# Altium schematic sheet MPU.SchDoc
size A4
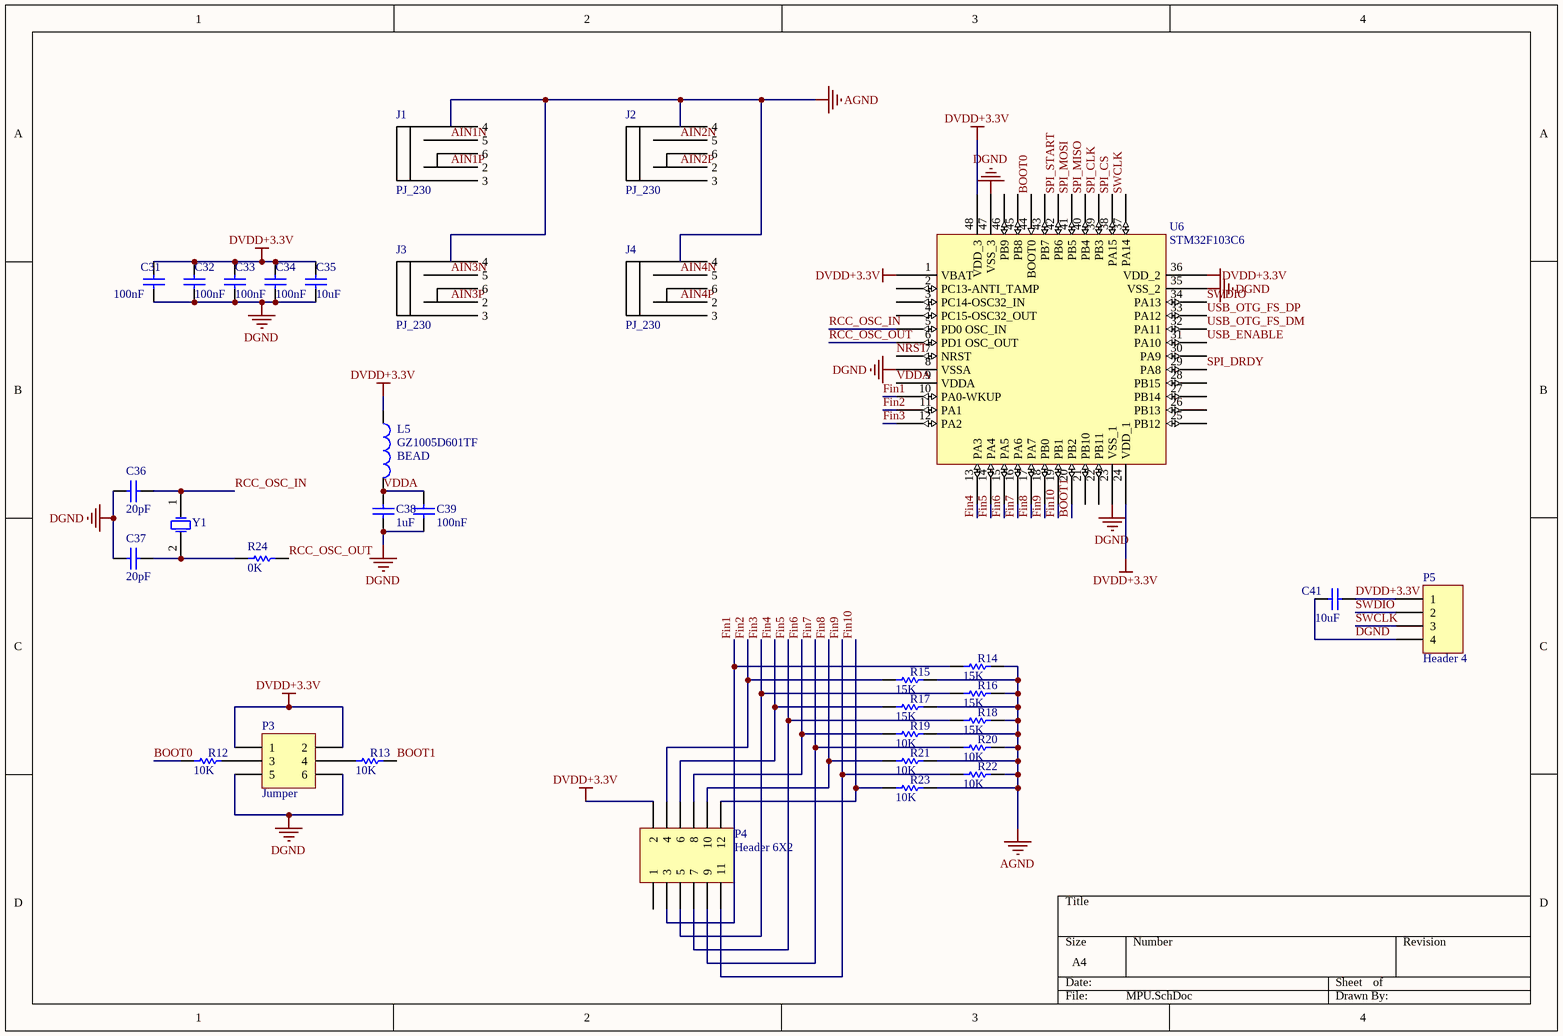
[diagram p0: MPU.SchDoc]

## Parts
C31  100nF  [1608[0603]]
C32  100nF  [1608[0603]]
C33  100nF  [1608[0603]]
C34  100nF  [1608[0603]]
C35  10uF  [1608[0603]]
C36  20pF  [1608[0603]]
C37  20pF  [1608[0603]]
C38  1uF  [1608[0603]]
C39  100nF  [1608[0603]]
C41  10uF  [1608[0603]]
J1  PJ_230  [PJ_230]
J2  PJ_230  [PJ_230]
J3  PJ_230  [PJ_230]
J4  PJ_230  [PJ_230]
L5  GZ1005D601TF  [0402-A]
P3  Jumper  [HDR2X3]
P4  Header 6X2  [HDR2X6]
P5  Header 4  [XH4]
R12  10K  [J1-0603]
R13  10K  [J1-0603]
R14  15K  [J1-0603]
R15  15K  [J1-0603]
R16  15K  [J1-0603]
R17  15K  [J1-0603]
R18  15K  [J1-0603]
R19  10K  [J1-0603]
R20  10K  [J1-0603]
R21  10K  [J1-0603]
R22  10K  [J1-0603]
R23  10K  [J1-0603]
R24  0K  [J1-0603]
U6  STM32F103C6  [STM32F103C8T6]
Y1  XTAL  [Crystal_HCM49]  (value not drawn)

## Nets
AGND: J1.4 J2.4 J3.4 J4.4 R14.2 R15.2 R16.2 R17.2 R18.2 R19.2 R20.2 R21.2 R22.2 R23.2
DGND: C31.1 C32.1 C33.1 C34.1 C35.1 C36.1 C37.1 C38.1 C39.1 C41.1 P3.5 P3.6 P5.4 U6.8(VSSA) U6.23(VSS_1) U6.35(VSS_2) U6.47(VSS_3)
DVDD+3.3V: C31.2 C32.2 C33.2 C34.2 C35.2 C41.2 L5.1 P3.1 P3.2 P4.2 P5.1 U6.1(VBAT) U6.24(VDD_1) U6.36(VDD_2) U6.48(VDD_3)
AIN1N: J1.5
AIN1P: J1.2
AIN2N: J2.5
AIN2P: J2.2
AIN3N: J3.5
AIN3P: J3.2
AIN4N: J4.5
AIN4P: J4.2
BOOT0: R12.1 U6.44(BOOT0)
BOOT1: R13.2 U6.20(PB2)
Fin1: P4.3 R14.1 U6.10(PA0-WKUP)
Fin2: P4.4 R15.1 U6.11(PA1)
Fin3: P4.5 R16.1 U6.12(PA2)
Fin4: P4.6 R17.1 U6.13(PA3)
Fin5: P4.7 R18.1 U6.14(PA4)
Fin6: P4.8 R19.1 U6.15(PA5)
Fin7: P4.9 R20.1 U6.16(PA6)
Fin8: P4.10 R21.1 U6.17(PA7)
Fin9: P4.11 R22.1 U6.18(PB0)
Fin10: P4.12 R23.1 U6.19(PB1)
NRST: U6.7(NRST)
RCC_OSC_IN: C36.2 U6.5(PD0_OSC_IN) Y1.1(OSC1)
RCC_OSC_OUT: R24.2 U6.6(PD1_OSC_OUT)
SPI_CLK: U6.39(PB3)
SPI_CS: U6.38(PA15)
SPI_DRDY: U6.29(PA8)
SPI_MISO: U6.40(PB4)
SPI_MOSI: U6.41(PB5)
SPI_START: U6.42(PB6)
SWCLK: P5.3 U6.37(PA14)
SWDIO: P5.2 U6.34(PA13)
USB_ENABLE: U6.31(PA10)
USB_OTG_FS_DM: U6.32(PA11)
USB_OTG_FS_DP: U6.33(PA12)
VDDA: C38.2 C39.2 L5.2 U6.9(VDDA)
NetC37_2: C37.2 R24.1 Y1.2(OSC2)
NetP3_3: P3.3 R12.2
NetP3_4: P3.4 R13.1

Not connected (* = marked no-connect by the designer): J1 3 6; J2 3 6; J3 3 6; J4 3 6; P4 1; U6 2(PC13-ANTI_TAMP) 3(PC14-OSC32_IN) 4(PC15-OSC32_OUT) 21(PB10) 22(PB11) 25(PB12) 26(PB13) 27(PB14) 28(PB15) 30(PA9) 43(PB7) 45(PB8) 46(PB9)

## Notes on the sheet
- (near L5) BEAD

## Library data of the parts
C31-C39 C41 = Cap: Capacitor; Published: 8-Jun-2000; LatestRevisionDate: 17-Jul-2002; LatestRevisionNote: Re-released for DXP Platform.; PackageReference: RAD-0.3; Publisher: Altium Limited; PackageDescription: Radial Cap, Thru-Hole; 2 Leads; 0.3 in Pin Spacing
  C31-C34 C39: Value: 100nF
  C35 C41: Value: 10uF
  C36 C37: Value: 20pF
  C38: Value: 1uF
J1-J4 = PJ_230: Phone Jack
L5 = Inductor: Code_IEC: 1005; Published: 8-Jun-2000; LatestRevisionDate: 29-May-2009; LatestRevisionNote: IPC-7351 Footprint Added.; PackageReference: 0402-A; Publisher: Altium Limited; PackageDescription: Chip Inductor; Code_JEITA: 0402
P3 = Header 3X2: Header, 3-Pin, Dual row; LatestRevisionDate: 17-Jul-2002; LatestRevisionNote: Re-released for DXP Platform.; Publisher: Altium Limited
P4 = Header 6X2: Header, 6-Pin, Dual row; LatestRevisionDate: 17-Jul-2002; LatestRevisionNote: Re-released for DXP Platform.; Publisher: Altium Limited
P5 = Header 4: Header, 4-Pin; LatestRevisionDate: 17-Jul-2002; LatestRevisionNote: Re-released for DXP Platform.; Publisher: Altium Limited
R12-R24 = Res1: Resistor; Published: 8-Jun-2000; LatestRevisionDate: 17-Jul-2002; LatestRevisionNote: Re-released for DXP Platform.; PackageReference: AXIAL-0.3; Publisher: Altium Limited; PackageDescription: Axial Device, Thru-Hole; 2 Leads; 0.3 in Pin Spacing
  R12 R13 R19-R23: Value: 10K
  R14-R18: Value: 15K
  R24: Value: 0K
U6 = STM32F103C8T6: IC MCU 32BIT 64KB FLASH 48LQFP
Y1 = XTAL: Crystal Oscillator; Published: 8-Jun-2000; LatestRevisionDate: 17-Jul-2002; LatestRevisionNote: Re-released for DXP Platform.; PackageReference: R38; Publisher: Altium Limited; PackageDescription: Crystal, Thru-Hole; 2 Leads; Body 3.1 x 8.2 mm (Dia.xH)